# Altium schematic sheet Sheet1.SchDoc
size A4; SheetNumber: 1; SheetTotal: 1
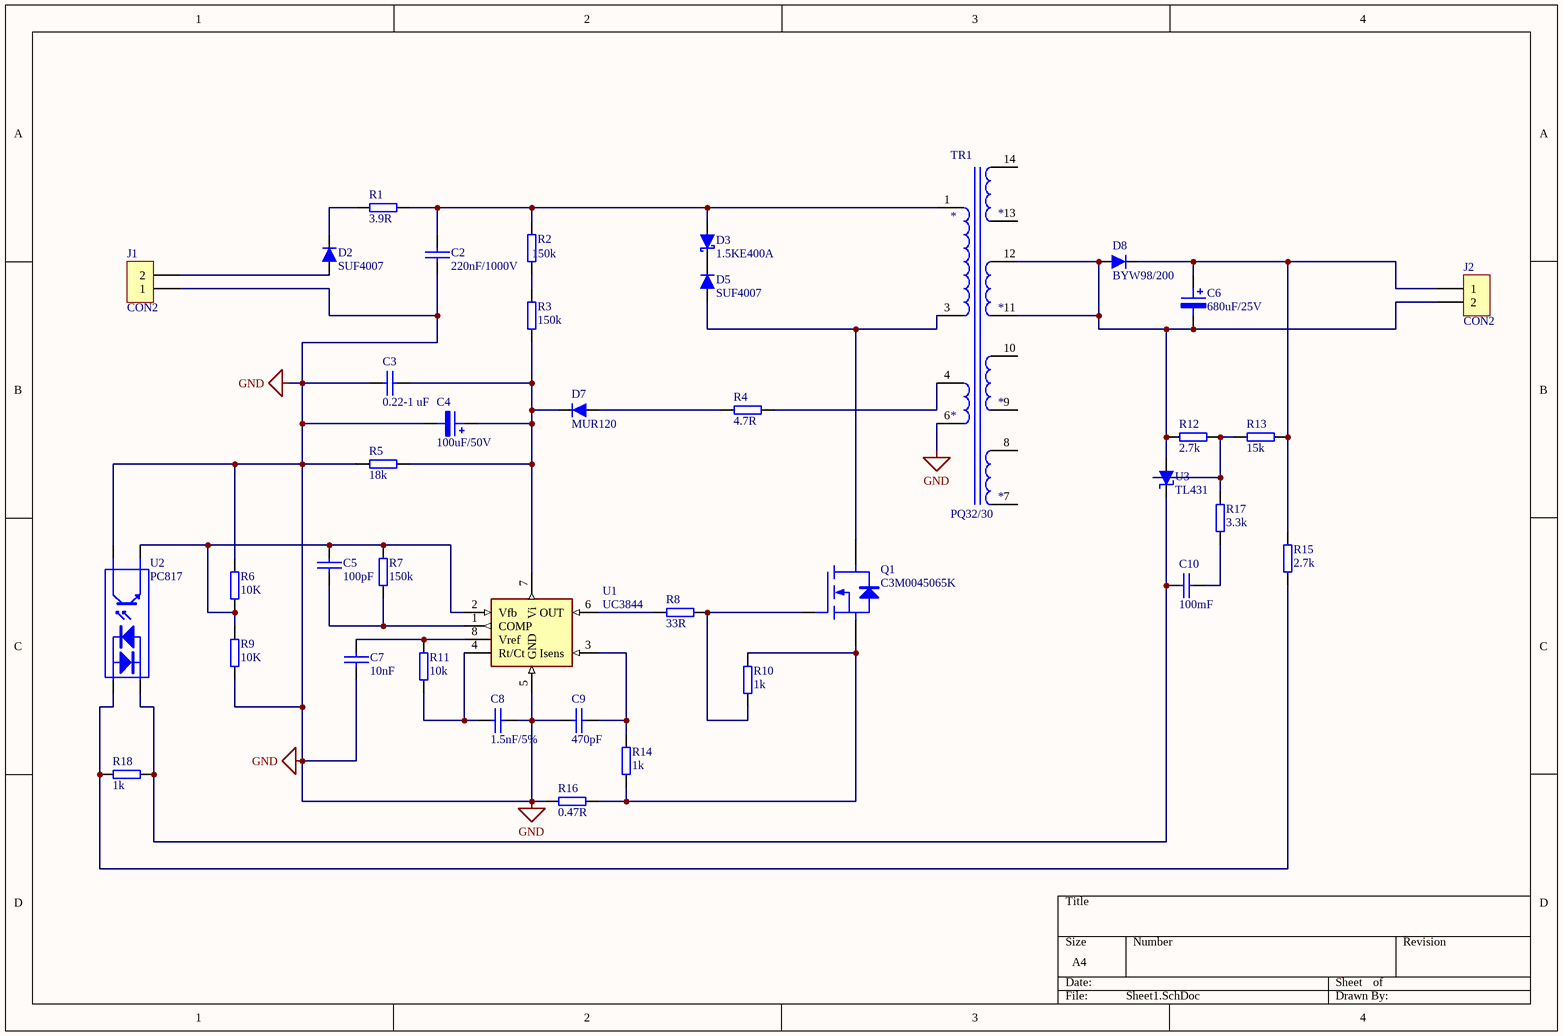
[diagram p0: Sheet1.SchDoc]

## Parts
C2  220nF/1000V  [MKP_R22,5_26,5x10,5]
C3  0.22-1 uF  [1206_O]
C4  100uF/50V  [AL04/10]
C5  100pF  [1206_O]
C6  680uF/25V  [AL04/18]
C7  10nF  [1206_O]
C8  1.5nF/5%  [1206_O]
C9  470pF  [1206_O]
C10  100mF  [1206_O]
D2  SUF4007  [DO-35]
D3  1.5KE400A  [DO-35]
D5  SUF4007  [DO-35]
D7  MUR120  [1206_D]
D8  BYW98/200  [DO-35]
J1  CON2  [MSTB/2A]
J2  CON2  [MSTB/2A]
Q1  C3M0045065K  [TO-247AC_V]
R1  3.9R  [MLT2]
R2  150k  [MLT2]
R3  150k  [MLT2]
R4  4.7R  [1206_O]
R5  18k  [1206_O]
R6  10K  [1206_O]
R7  150k  [1206_O]
R8  33R  [1206_O]
R9  10K  [1206_O]
R10  1k  [1206_O]
R11  10k  [1206_O]
R12  2.7k  [1206_O]
R13  15k  [1206_O]
R14  1k  [1206_O]
R15  2.7k  [1206_O]
R16  0.47R  [1206_O]
R17  3.3k  [1206_O]
R18  1k  [1206_O]
TR1  PQ32/30  [ETD39]
U1  UC3844  [DIP8]
U2  PC817  [DIP4]
U3  TL431  [SOT23]

## Nets
GND: C2.2 C3.1 C4.2 C7.1 C8.2 C9.1 J1.1 R5.2 R6.1 R9.2 R16.1 TR1.6 U1.5(GND) U2.4
NetC2_1: C2.1 D3.A R1.1 R2.2 TR1.1
NetC3_2: C3.2 C4.1 D7.K R3.1 R5.1 U1.7(Vi)
NetC5_1: C5.1 R7.2 U1.1(COMP)
NetC5_2: C5.2 R6.2 R7.1 R9.1 U1.2(Vfb) U2.3
NetC6_1: C6.1 D8.K J2.1 R13.1 R15.1
NetC6_2: C6.2 D8.A J2.2 R12.1 TR1.11 TR1.12 U3.C
NetC7_2: C7.2 R11.1 U1.8(Vref)
NetC8_1: C8.1 R11.2 U1.4(Rt/Ct)
NetC9_2: C9.2 R14.1 U1.3(Isens)
NetC10_1: C10.1 R18.1 U2.2 U3.B
NetC10_2: C10.2 R17.2
NetD2_A: D2.A J1.2
NetD2_K: D2.K R1.2
NetD3_K: D3.K D5.K
NetD5_A: D5.A Q1.C TR1.3
NetD7_A: D7.A R4.1
NetQ1_B: Q1.B R8.2 R10.2
NetQ1_E: Q1.E R10.1 R14.2 R16.2
NetR2_1: R2.1 R3.2
NetR4_2: R4.2 TR1.4
NetR8_1: R8.1 U1.6(OUT)
NetR12_2: R12.2 R13.2 R17.1 U3.E
NetR15_2: R15.2 R18.2 U2.1

Not connected (* = marked no-connect by the designer): TR1 7 8 9 10 13 14

## Library data of the parts
C2 C3 C5 C7-C10 = C: Capacitor
C4 C6 = C-EL: Electrolytic Capacitor
D2 D5 D7 D8 = DIODE
D3 = DIODE_SCHOTTKY
J1 J2 = CON2: Connector
Q1 = MOSFET
R1-R18 = R
TR1 = TRANS9
U2 = OPTOISO1: Optoisolator
U3 = VREF_SOT23